# EAGLE design uno ethernet sheild (EAGLE 9.5.2)
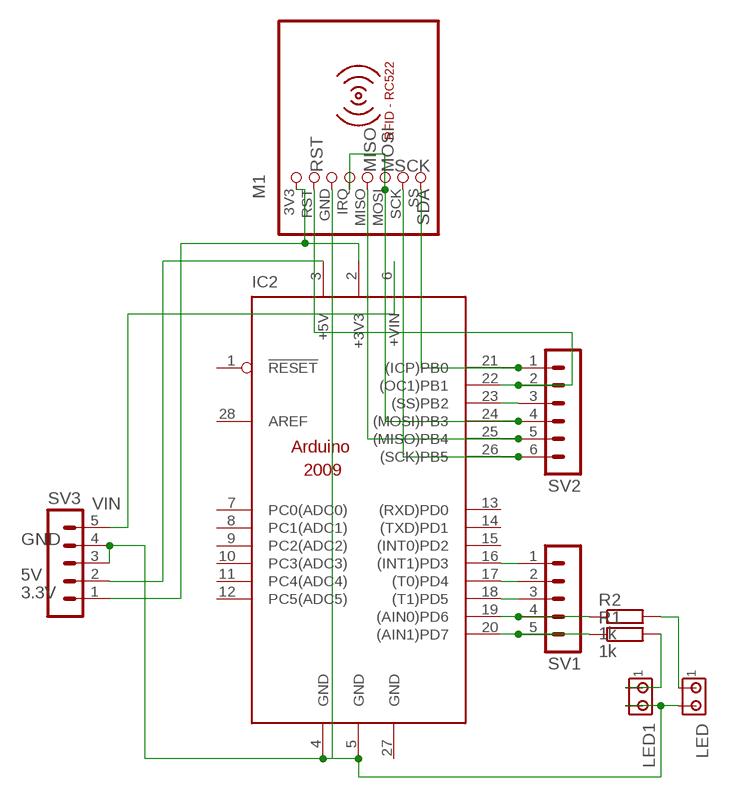
[diagram p0: schematic, sheet 1]

## Parts
IC2  ARDUINO2009_PIN_12  [ARDUINO2009_2]
LED  MTA02-100  [10X02MTA]
LED1  MTA02-100  [10X02MTA]
M1  RFID-RC522  [RFID-RC522]
R1  1k  R-EU_0207/10  [0207/10]
R2  1k  R-EU_0207/10  [0207/10]
SV1  MA05-1  [MA05-1]
SV2  MA06-1  [MA06-1]
SV3  MA05-1  [MA05-1]

## Nets
3.3V: IC2.2(+3V3) M1.3V3 SV3.1
5V: IC2.3(+5V) SV3.2
GND: IC2.4(GND) IC2.5(GND) LED1.2 LED.2 M1.GND SV3.3 SV3.4
MISO: IC2.25((MISO)PB4) M1.MISO SV2.5
MOSI: IC2.24((MOSI)PB3) M1.IRQ M1.MOSI SV2.4
N$1: LED1.1 R1.2
N$3: LED.1 R2.2
N$9: IC2.20((AIN1)PD7) R1.1 SV1.5
N$10: IC2.19((AIN0)PD6) R2.1 SV1.4
N$11: IC2.18((T1)PD5) SV1.3
N$12: IC2.17((T0)PD4) SV1.2
N$13: IC2.16((INT1)PD3) SV1.1
N$14: IC2.23((SS)PB2) SV2.3
RST: IC2.22((OC1)PB1) M1.RST SV2.2
SCK: IC2.26((SCK)PB5) M1.SCK SV2.6
SDA: IC2.21((ICP)PB0) M1.SS SV2.1
VIN: IC2.6(+VIN) SV3.5
Unconnected: IC2.1(!RESET) IC2.7(PC0(ADC0)) IC2.8(PC1(ADC1)) IC2.9(PC2(ADC2)) IC2.10(PC3(ADC3)) IC2.11(PC4(ADC4)) IC2.12(PC5(ADC5)) IC2.13((RXD)PD0) IC2.14((TXD)PD1) IC2.15((INT0)PD2) IC2.28(AREF)

## Power pins joined to a net without a drawn wire
GND: IC2.27(GND)

## Library data of the parts
IC2 = arduino:ARDUINO2009_PIN_1: The Arduino Duemilanove ("2009") is a microcontroller board based on the ATmega168 or ATmega328. - 14 digital input/output pins (of which 6 can be used as PWM outputs) - 6 analog inputs, a 16 MHz crystal oscillator - USB connection - power jack - ISP header - reset button It contains everything needed to support the microcontroller; simply connect it to a computer with a USB cable or power it with a AC-to-DC adapter or battery to get started http://arduino.cc/en/Main/ArduinoBoardDuemilanove
LED LED1 = con-amp:MTA02-100: AMP connector
M1 = mfrc522-module:RFID-RC522: RFID-RC522 MFRC-522 based breakout board
R1 R2 = rcl:R-EU_: RESISTOR, European symbol; SPICEPREFIX: R
SV1 SV3 = con-lstb:MA05-1: PIN HEADER; OC_FARNELL: unknown; OC_NEWARK: unknown
SV2 = con-lstb:MA06-1: PIN HEADER; OC_FARNELL: unknown; OC_NEWARK: unknown

## Board
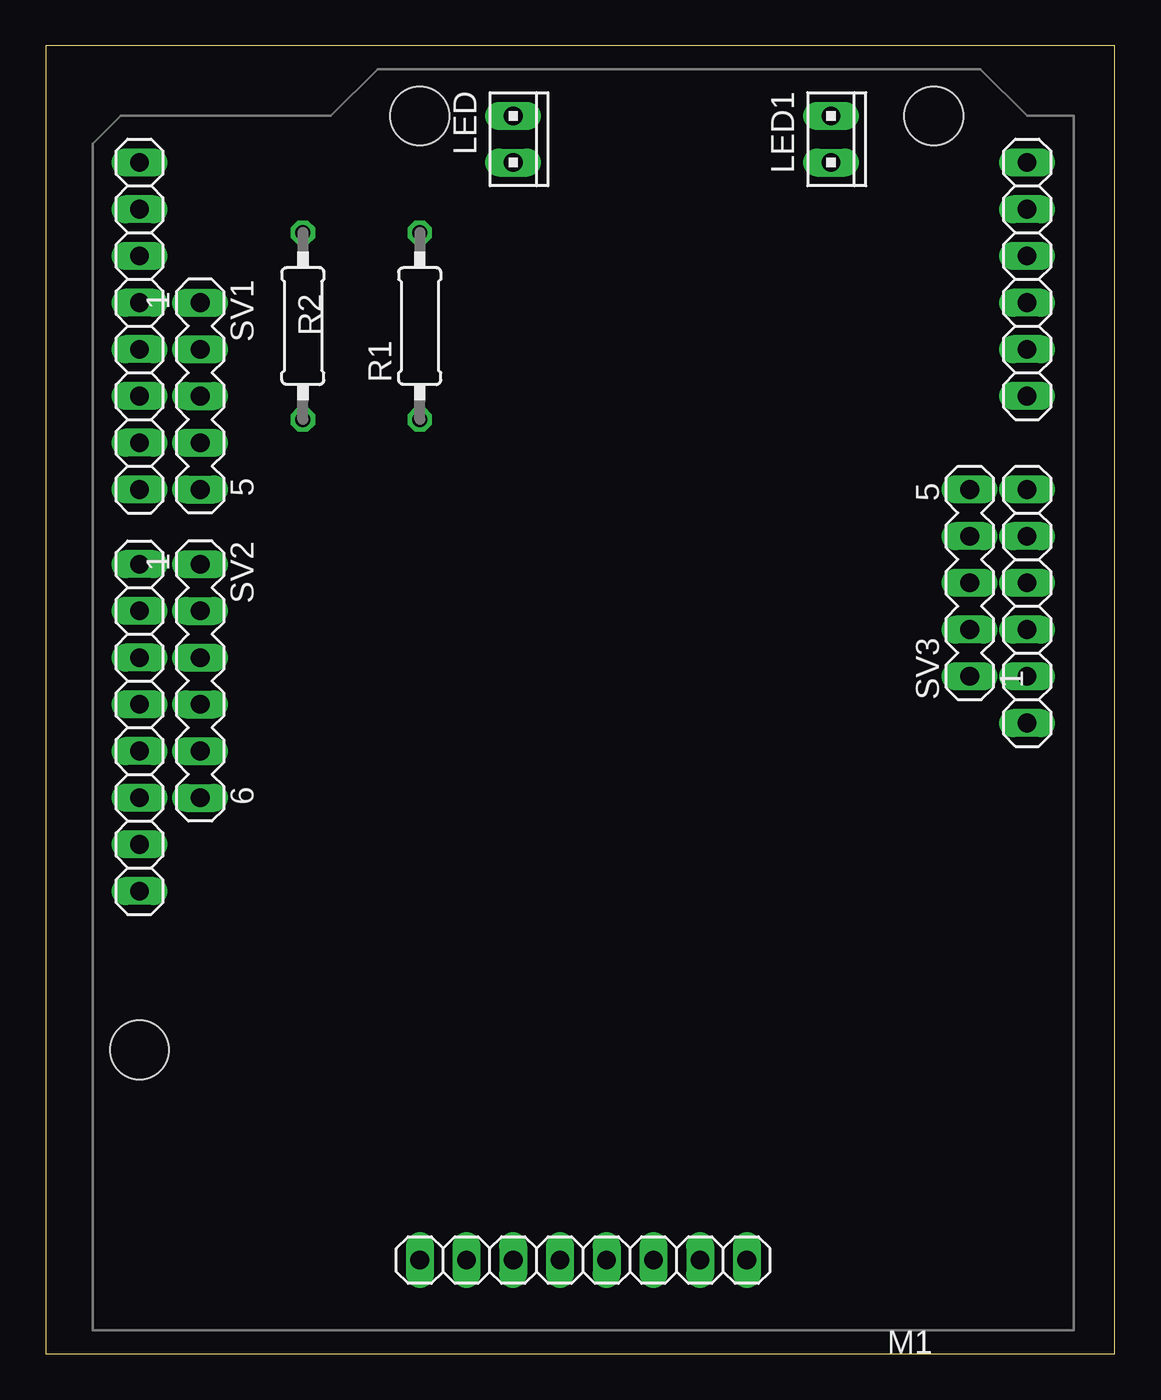
[diagram p1: board, top side]
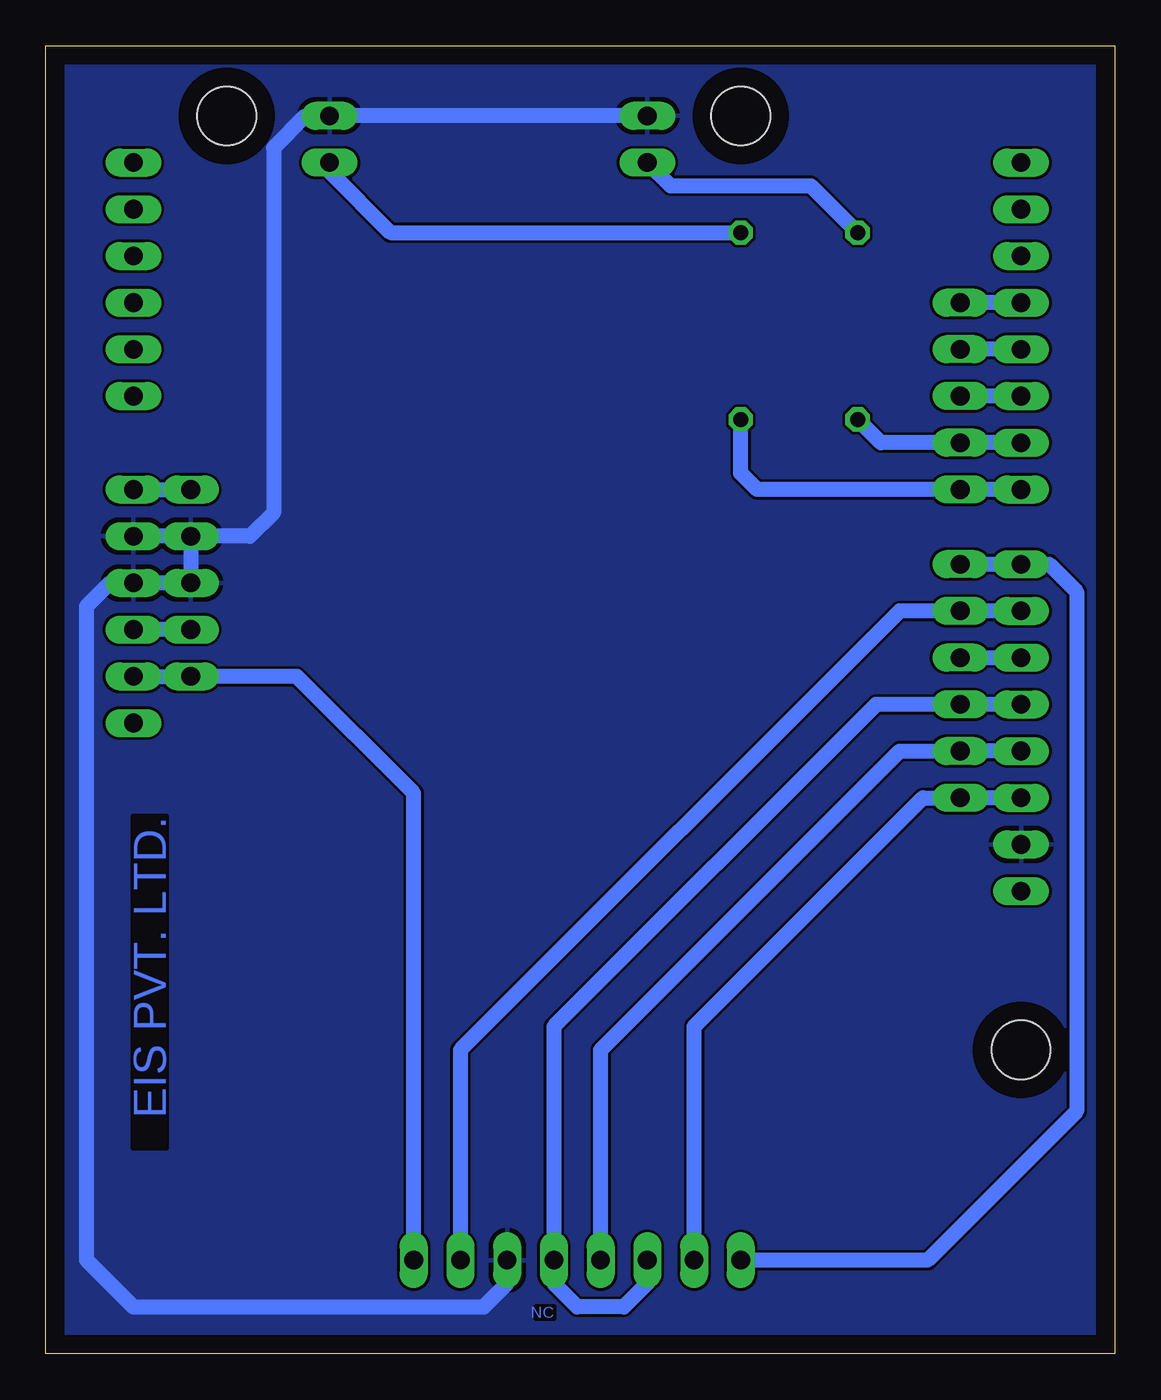
[diagram p2: board, bottom side, seen from below]

Size 58.09 x 71.11 mm. Coordinates in mm from the lower left corner, seen from the top.
Outline: 0,0 58.09,0 58.09,71.11 0,71.11 0,0
Copper layers (1*16): Top 0.035mm / dielectric 1.5mm / Bottom 0.035mm
Design rules "default": minimum track width 6mil, minimum drill 0.35mm, track to track 6mil, track to pad 6mil, pad to pad 6mil, via to via 6mil, smd to smd 6mil, copper to edge 40mil, drill to drill 6mil, minimum pad ring 10mil, minimum via ring 8mil, stop-mask expansion 4mil, vias tented up to drill 0mil, thermal gap 10mil

### Footprints (pad centres in the part's own frame; a part is rotated, then mirrored left to right if it is on the bottom)
ARDUINO2009_2 = drill 1.016 long: 1 33.02,2.54; 2 35.56,2.54; 3 38.1,2.54; 4 40.64,2.54; 5 43.18,2.54; 6 45.72,2.54; 7 50.8,2.54; 8 53.34,2.54; 9 55.88,2.54; 10 58.42,2.54; 11 60.96,2.54; 12 63.5,2.54; 13 63.5,50.8; 14 60.96,50.8; 15 58.42,50.8; 16 55.88,50.8; 17 53.34,50.8; 18 50.8,50.8; 19 48.26,50.8; 20 45.72,50.8; 21 41.656,50.8; 22 39.116,50.8; 23 36.576,50.8; 24 34.036,50.8; 25 31.496,50.8; 26 28.956,50.8; 27 26.416,50.8; 28 23.876,50.8 | hole 3.2: 15.24,50.8; 66.04,35.56; 66.04,7.62
10X02MTA = drill 1.016 long: 1 1.27,0; 2 -1.27,0
RFID-RC522 = drill 1.016 long: 3V3 -8.89,0; GND -3.81,0; IRQ -1.27,0; MISO 1.27,0; MOSI 3.81,0; RST -6.35,0; SCK 6.35,0; SS 8.89,0
0207/10 = drill 0.813 octagon: 1 -5.08,0; 2 5.08,0
MA05-1 = drill 1.016 long: 1 -5.08,0; 2 -2.54,0; 3 0,0; 4 2.54,0; 5 5.08,0
MA06-1 = drill 1.016 long: 1 -6.35,0; 2 -3.81,0; 3 -1.27,0; 4 1.27,0; 5 3.81,0; 6 6.35,0

### Placement (x,y rotation side)
IC2  55.88,1.27 90 top
LED  25.4,66.04 270 top
LED1  42.67,66.04 270 top
M1  29.21,5.08 180 top
R1  20.32,55.88 90 top
R2  13.97,55.88 90 top
SV1  8.38,52.07 270 top
SV2  8.38,36.58 270 top
SV3  50.22,41.91 90 top

### Tracks (layer width: path | path; a pad name or v marks a point on that pad's centre or on a via)
3.3V
  Bottom 0.813: IC2.2 SV3.1 44.45,36.83 38.1,30.48 M1.3V3
5V
  Bottom 0.813: SV3.2 IC2.3
GND
  Bottom 0.813: M1.GND 33.02,3.81 34.29,2.54 53.34,2.54 55.88,5.08 55.88,40.64 54.61,41.91 IC2.4 SV3.3 SV3.4 | SV3.4 46.99,44.45 45.72,45.72 45.72,65.58 43.99,67.31 LED1.2 LED.2 | SV3.4 IC2.5
  pour Bottom: 0.13,71.12 58.04,71.12 58.04,0.13 0.13,0.13
MISO
  Bottom 0.813: M1.MISO 27.94,16.51 11.68,32.77 SV2.5 IC2.25
MOSI
  Bottom 0.813: M1.MOSI 25.4,3.81 26.67,2.54 29.21,2.54 30.48,3.81 M1.IRQ 30.48,17.78 12.95,35.31 SV2.4 IC2.24
N$1
  Bottom 0.813: R1.2 39.37,60.96 42.67,64.26 LED1.1
N$3
  Bottom 0.813: R2.2 16.51,63.5 24.13,63.5 LED.1
N$9
  Bottom 0.813: IC2.20 SV1.5 19.43,46.99 20.32,47.88 R1.1
N$10
  Bottom 0.813: IC2.19 SV1.4 12.7,49.53 R2.1
N$11
  Bottom 0.813: IC2.18 SV1.3
N$12
  Bottom 0.813: IC2.17 SV1.2
N$13
  Bottom 0.813: IC2.16 SV1.1
N$14
  Bottom 0.813: SV2.3 IC2.23
RST
  Bottom 0.813: M1.RST 35.56,16.51 11.68,40.39 SV2.2 IC2.22
SCK
  Bottom 0.813: M1.SCK 22.86,17.78 10.41,30.23 SV2.6 IC2.26
SDA
  Bottom 0.813: M1.SS 10.16,5.08 2.06,13.18 2.06,41.43 3.56,42.93 IC2.21 SV2.1
VIN
  Bottom 0.813: IC2.6 SV3.5

### Text on the board
Bottom: EIS PVT. LTD. | NC